# EAGLE design stepperdriver (EAGLE 5.03)
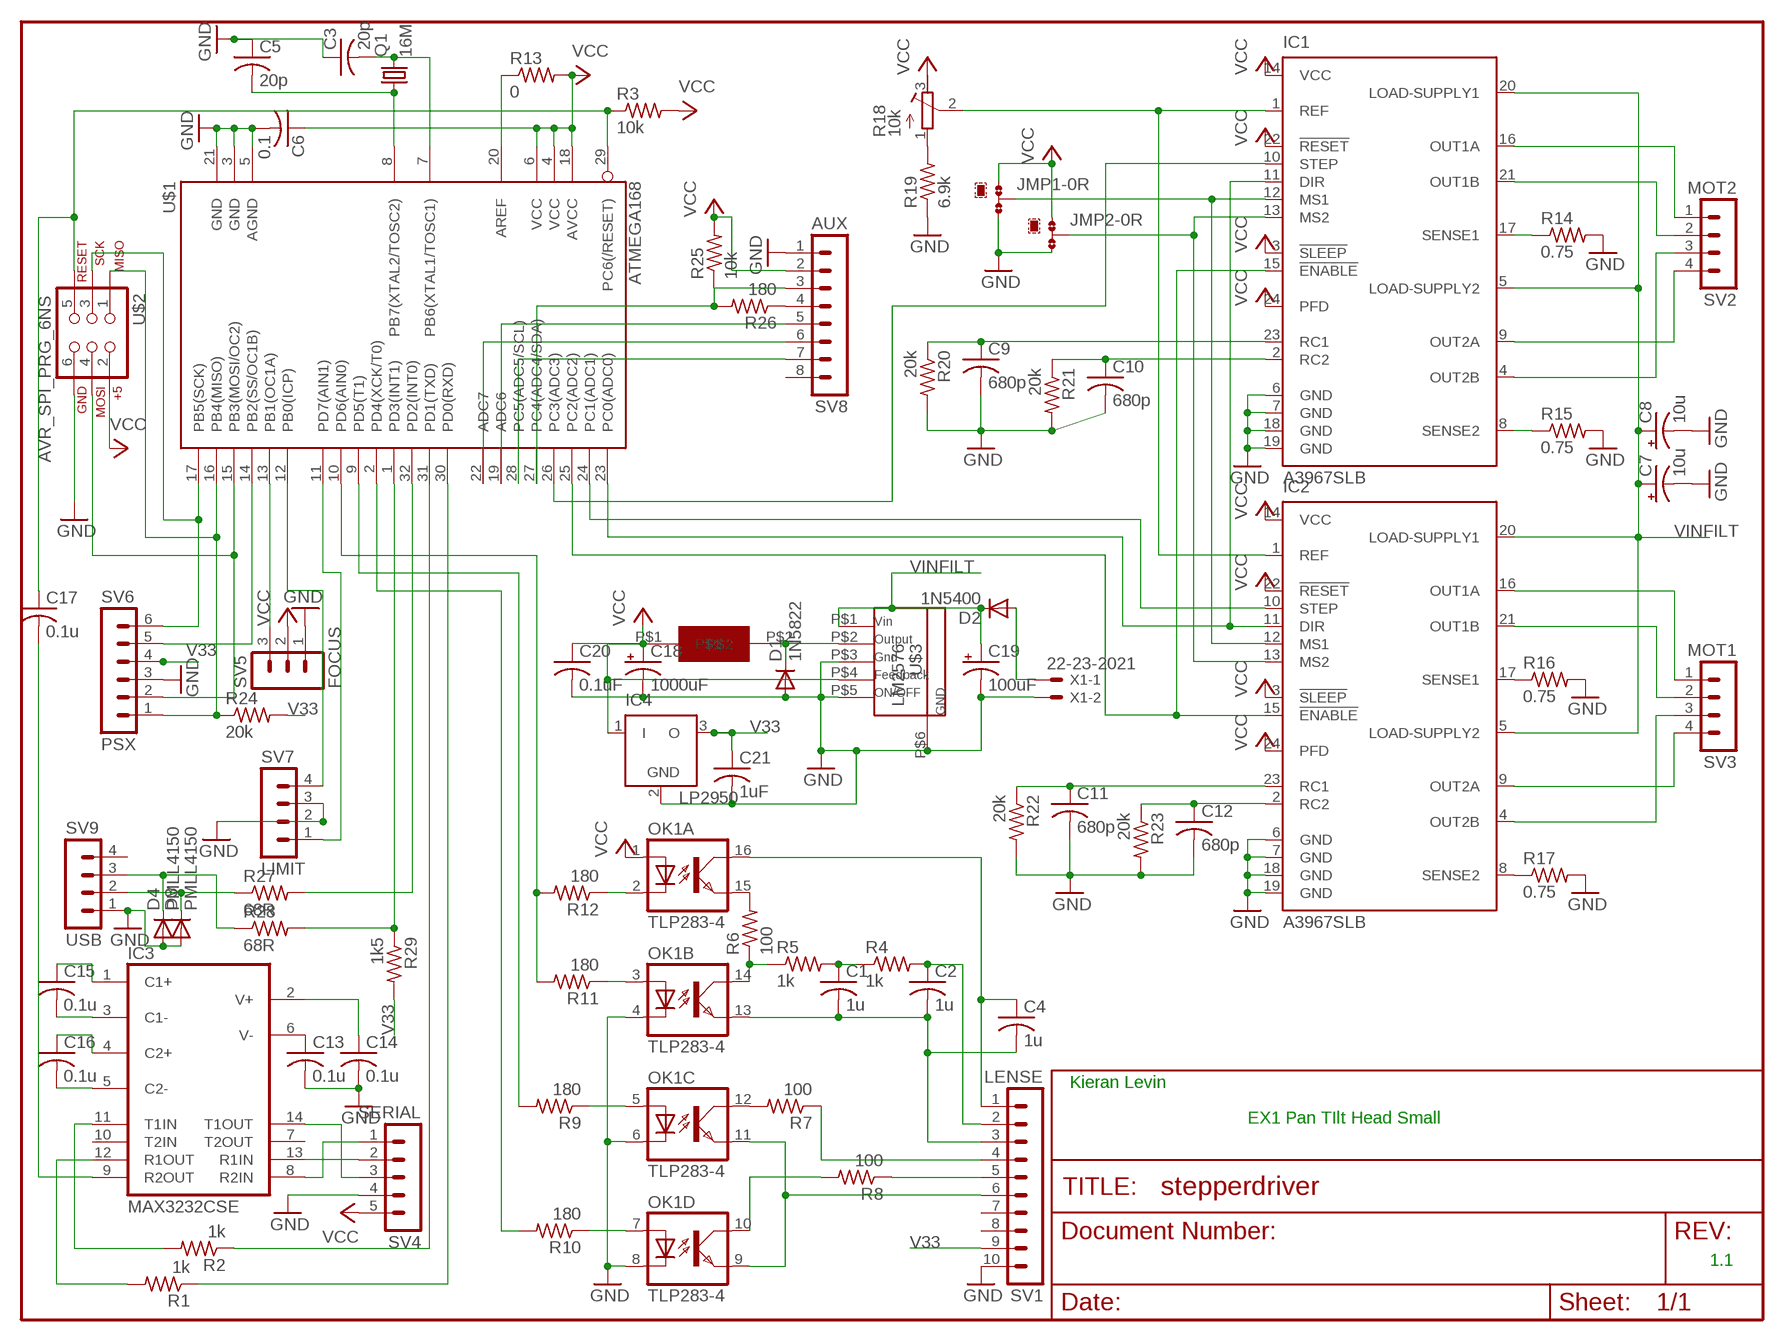
[diagram p0: schematic, sheet 1]

## Parts
C1  1u  C-USC1206  [C1206]
C2  1u  C-USC1206  [C1206]
C3  20p  C-USC1206  [C1206]
C4  1u  C-USC1206  [C1206]
C5  20p  C-USC1206  [C1206]
C6  0.1  C-USC1206  [C1206]
C7  10u  CPOL-USE2.5-5  [E2,5-5]
C8  10u  CPOL-USE2.5-5  [E2,5-5]
C9  680p  C-USC1206  [C1206]
C10  680p  C-USC1206  [C1206]
C11  680p  C-USC1206  [C1206]
C12  680p  C-USC1206  [C1206]
C13  0.1u  C-USC1206  [C1206]
C14  0.1u  C-USC1206  [C1206]
C15  0.1u  C-USC1206  [C1206]
C16  0.1u  C-USC1206  [C1206]
C17  0.1u  C-USC1206  [C1206]
C18  1000uF  CPOL-USE3.5-8  [E3,5-8]
C19  100uF  CPOL-USE3.5-8  [E3,5-8]
C20  0.1uF  C-USC1206  [C1206]
C21  1uF  C-USC1206  [C1206]
D1  1N5822  1N5400  [DO201-15]
D2  1N5400  [DO201-15]
D3  PMLL4150  [SOD80C]
D4  PMLL4150  [SOD80C]
IC1  A3967SLB  [SO24W]
IC2  A3967SLB  [SO24W]
IC3  MAX3232CSE  [SO16]
IC4  LP2950  [DPACK]
JMP1  0R-JUMPA  [A0R-JMP]
JMP2  0R-JUMPA  [A0R-JMP]
OK1  TLP283-4  [MINI-FLAT-16]
Q1  16M  CRYSTALHC49S  [HC49/S]
R1  1k  R-US_R1206  [R1206]
R2  1k  R-US_R1206  [R1206]
R3  10k  R-US_R1206  [R1206]
R4  1k  R-US_R1206  [R1206]
R5  1k  R-US_R1206  [R1206]
R6  100  R-US_R1206  [R1206]
R7  100  R-US_R1206  [R1206]
R8  100  R-US_R1206  [R1206]
R9  180  R-US_R1206  [R1206]
R10  180  R-US_R1206  [R1206]
R11  180  R-US_R1206  [R1206]
R12  180  R-US_R1206  [R1206]
R13  0  R-US_R1206  [R1206]
R14  0.75  R-US_R1206  [R1206]
R15  0.75  R-US_R1206  [R1206]
R16  0.75  R-US_R1206  [R1206]
R17  0.75  R-US_R1206  [R1206]
R18  10k  R-TRIMM3314J  [RTRIM3314J]
R19  6.9k  R-US_R1206  [R1206]
R20  20k  R-US_R1206  [R1206]
R21  20k  R-US_R1206  [R1206]
R22  20k  R-US_R1206  [R1206]
R23  20k  R-US_R1206  [R1206]
R24  20k  R-US_R1206  [R1206]
R25  10k  R-US_R1206  [R1206]
R26  180  R-US_R1206  [R1206]
R27  68R  R-US_R1206  [R1206]
R28  68R  R-US_R1206  [R1206]
R29  1k5  R-US_R1206  [R1206]
SV1  LENSE  MA10-1  [MA10-1]
SV2  MOT2  MA04-1  [MA04-1]
SV3  MOT1  MA04-1  [MA04-1]
SV4  SERIAL  MA05-1  [MA05-1]
SV5  FOCUS  MA03-1  [MA03-1]
SV6  PSX  MA06-1  [MA06-1]
SV7  LIMIT  MA04-1  [MA04-1]
SV8  AUX  MA08-1  [MA08-1]
SV9  USB  MA04-1  [MA04-1]
U$1  ATMEGA168  [TQFP32-08]
U$2  AVR_SPI_PRG_6NS  [2X3-NS]
U$3  LM2576  [TO263-5]
U$4  IND-DR127-COILTRONIX-  [IND-DR127-SERIES]
X1  22-23-2021  [22-23-2021]

## Nets
GND: C3.1 C5.1 C6.2 C7.- C8.- C9.2 C10.2 C11.2 C12.2 C13.2 C14.2 C18.- C19.- C20.2 C21.2 D1.A D3.A D4.A IC1.6(GND) IC1.7(GND) IC1.18(GND) IC1.19(GND) IC2.6(GND) IC2.7(GND) IC2.18(GND) IC2.19(GND) IC4.2(GND) JMP1.3 JMP2.3 OK1.4(B:C) OK1.6(C:C) OK1.8(D:C) R14.2 R15.2 R16.2 R17.2 R19.1 R20.2 R21.2 R22.2 R23.2 SV1.10 SV4.4 SV5.1 SV6.3 SV7.2 SV7.3 SV8.1 SV9.1 U$1.3(GND) U$1.5(AGND) U$1.21(GND) U$2.6 U$3.P$3 U$3.P$5 U$3.P$6 X1.2
N$1: C17.1 R3.1 U$1.29(PC6(/RESET)) U$2.5
N$2: SV6.2 U$1.15(PB3(MOSI/OC2)) U$2.4
N$3: R24.1 SV6.1 U$1.16(PB4(MISO)) U$2.1
N$4: SV6.6 U$1.17(PB5(SCK)) U$2.3
N$5: OK1.15(A:EMIT) R6.2
N$6: OK1.14(B:COL) R5.1 R6.1
N$7: C1.1 R4.1 R5.2
N$8: C2.1 R4.2 SV1.2
N$9: C1.2 C2.2 C4.2 OK1.13(B:EMIT) SV1.3
N$10: OK1.12(C:COL) R7.2
N$11: OK1.10(D:COL) R8.2
N$12: C4.1 OK1.16(A:COL) SV1.1
N$13: R7.1 SV1.4
N$14: R8.1 SV1.5
N$15: OK1.9(D:EMIT) OK1.11(C:EMIT) SV1.6
N$16: C3.2 Q1.2 U$1.7(PB6(XTAL1/TOSC1))
N$17: OK1.2(A:C) R12.1
N$18: OK1.3(B:A) R11.1
N$19: OK1.5(C:A) R9.1
N$20: OK1.7(D:A) R10.1
N$21: C5.2 Q1.1 U$1.8(PB7(XTAL2/TOSC2))
N$22: R11.2 R12.2 U$1.10(PD6(AIN0))
N$23: IC1.16(OUT1A) SV2.1
N$25: R13.1 U$1.20(AREF)
N$26: IC1.21(OUT1B) SV2.2
N$27: IC1.9(OUT2A) SV2.4
N$28: IC1.4(OUT2B) SV2.3
N$29: IC1.8(SENSE2) R15.1
N$30: IC2.17(SENSE1) R16.1
N$31: IC2.8(SENSE2) R17.1
N$32: IC1.17(SENSE1) R14.1
N$33: IC2.9(OUT2A) SV3.4
N$34: IC2.4(OUT2B) SV3.3
N$35: IC2.21(OUT1B) SV3.2
N$36: IC2.16(OUT1A) SV3.1
N$37: IC1.12(MS1) IC2.12(MS1) JMP1.2
N$38: SV6.5 U$1.14(PB2(SS/OC1B))
N$39: IC1.13(MS2) IC2.13(MS2) JMP2.2
N$40: C10.1 IC1.2(RC2) R21.1
N$41: C11.1 IC2.23(RC1) R22.1
N$42: R18.1(E) R19.2
N$43: IC1.15(!ENABLE) IC2.15(!ENABLE) U$1.25(PC2(ADC2))
N$44: C12.1 IC2.2(RC2) R23.1
N$45: C9.1 IC1.23(RC1) R20.1
N$46: IC1.1(REF) IC2.1(REF) R18.2(S)
N$47: SV5.3 U$1.13(PB1(OC1A))
N$48: IC1.11(DIR) IC2.11(DIR) U$1.23(PC0(ADC0))
N$49: IC1.10(STEP) U$1.26(PC3(ADC3))
N$50: IC2.10(STEP) U$1.24(PC1(ADC1))
N$51: IC3.11(T1IN) R2.2
N$52: C15.2 IC3.3(C1-)
N$53: C15.1 IC3.1(C1+)
N$54: C16.1 IC3.4(C2+)
N$55: C16.2 IC3.5(C2-)
N$56: C13.1 IC3.6(V-)
N$57: C14.1 IC3.2(V+)
N$58: R2.1 U$1.31(PD1(TXD))
N$59: R1.1 U$1.30(PD0(RXD))
N$60: IC3.12(R1OUT) R1.2
N$61: C17.2 IC3.9(R2OUT)
N$62: R9.2 U$1.9(PD5(T1))
N$63: IC3.8(R2IN) SV4.1
N$64: IC3.13(R1IN) SV4.2
N$65: IC3.14(T1OUT) SV4.3
N$66: R10.2 U$1.2(PD4(XCK/T0))
N$67: D1.C U$3.P$2 U$4.P$2
N$68: R26.1 SV8.4
N$69: SV7.4 U$1.12(PB0(ICP))
N$70: SV7.1 U$1.11(PD7(AIN1))
N$71: D2.A X1.1
N$72: SV8.7 U$1.28(PC5(ADC5/SCL))
N$73: R25.1 R26.2 SV8.3 U$1.27(PC4(ADC4/SDA))
N$74: SV8.5 U$1.19(ADC6)
N$75: SV8.6 U$1.22(ADC7)
N$76: R27.2 U$1.32(PD2(INT0))
N$77: R28.2 R29.1 U$1.1(PD3(INT1))
N$79: D3.C R27.1 SV9.2
N$80: D4.C R28.1 SV9.3
V33: C21.1 IC4.3(O) R24.2 R29.2 SV1.9 SV6.4
VCC: C6.1 C18.+ C20.1 IC1.3(!SLEEP) IC1.14(VCC) IC1.22(!RESET) IC1.24(PFD) IC2.3(!SLEEP) IC2.14(VCC) IC2.22(!RESET) IC2.24(PFD) IC4.1(I) JMP1.1 JMP2.1 OK1.1(A:A) R3.2 R13.2 R18.3(A) R25.2 SV4.5 SV5.2 SV8.2 U$1.4(VCC) U$1.6(VCC) U$1.18(AVCC) U$2.2 U$3.P$4 U$4.P$1
VINFILT: C7.+ C8.+ C19.+ D2.C IC1.5(LOAD-SUPPLY2) IC1.20(LOAD-SUPPLY1) IC2.5(LOAD-SUPPLY2) IC2.20(LOAD-SUPPLY1) U$3.P$1
Unconnected: IC3.7(T2OUT) IC3.10(T2IN) SV1.7 SV1.8 SV8.8 SV9.4

## Notes on the sheet
- Kieran Levin
- EX1 Pan TIlt Head Small
- 1.1

## Power pins joined to a net without a drawn wire
GND: IC3.15(GND)
VCC: IC3.16(VCC)

## Library data of the parts
C1-C6 C9-C17 C20 C21 = rcl:C-US: CAPACITOR, American symbol
C7 C8 C18 C19 = rcl:CPOL-US: POLARIZED CAPACITOR, American symbol
D1 D2 = diode:1N5400: DIODE standard rectifier, 3 A, 50 V (Motorola)
D3 D4 = diode:PMLL4150: DIODE high speed
IC1 IC2 = allegro:A3967SLB: MICROSTEPPING DRIVER WITH TRANSLATOR Source: 3967.pdf
IC3 = maxim:MAX3232*: True RS-232 Transceivers 3.0V to 5.5V, Low-Power up to 1Mbps, Using Four 0.1µF External Capacitors Source: http://pdfserv.maxim-ic.com/en/ds/MAX3222-MAX3241.pdf
IC4 = linear:LP2950: 100 mA, Low Power Low Dropout Voltage Regulator Source: http://www.onsemi.com/pub/Collateral/LP2950-D.PDF
JMP1 JMP2 = jump-0r-smd:0R-JUMP: SMD 0R 0805 Jumper
OK1 = optocoupler:TLP283-4: TOSHIBA PHOTOCOUPLER GaAs IRED & PHOTO-TRANSISTOR Source: http://www.semicon.toshiba.co.jp/td/en/Opto/Photocoupler/en_20050928_TLP283_datasheet.pdf
Q1 = crystal:CRYSTAL: CRYSTAL
R1-R17 R19-R29 = rcl:R-US_: RESISTOR, American symbol
R18 = rcl:R-TRIMM: Trimm resistor
SV1 = con-lstb:MA10-1: PIN HEADER
SV2 SV3 SV7 SV9 = con-lstb:MA04-1: PIN HEADER
SV4 = con-lstb:MA05-1: PIN HEADER
SV5 = con-lstb:MA03-1: PIN HEADER
SV6 = con-lstb:MA06-1: PIN HEADER
SV8 = con-lstb:MA08-1: PIN HEADER
U$1 = SparkFun:ATMEGA168
U$2 = SparkFun:AVR_SPI_PRG_6: AVR ISP 6 Pin This is the reduced ISP connector for AVR programming. Common on Arduino. This footprint will take up less PCB space and can be used with a 10-pin to 6-pin adapter such as SKU: BOB-08508
U$3 = KieranCustom:LM2576
U$4 = KieranCustom:IND-DR127-COILTRONIX-: Series DR Inductance 100µH Tolerance ±20% Package / Case 0.492" L x 0.492" W x 0.314" H (12.50mm x 12.50mm x 8.00mm) Current 1.96A Mounting Type Surface Mount Manufacturer Part Number DR127-101-R Digi-Key Part Number 513-1038-1-ND
X1 = con-molex:22-23-2021: .100" (2.54mm) Center Header - 2 Pin

## Board
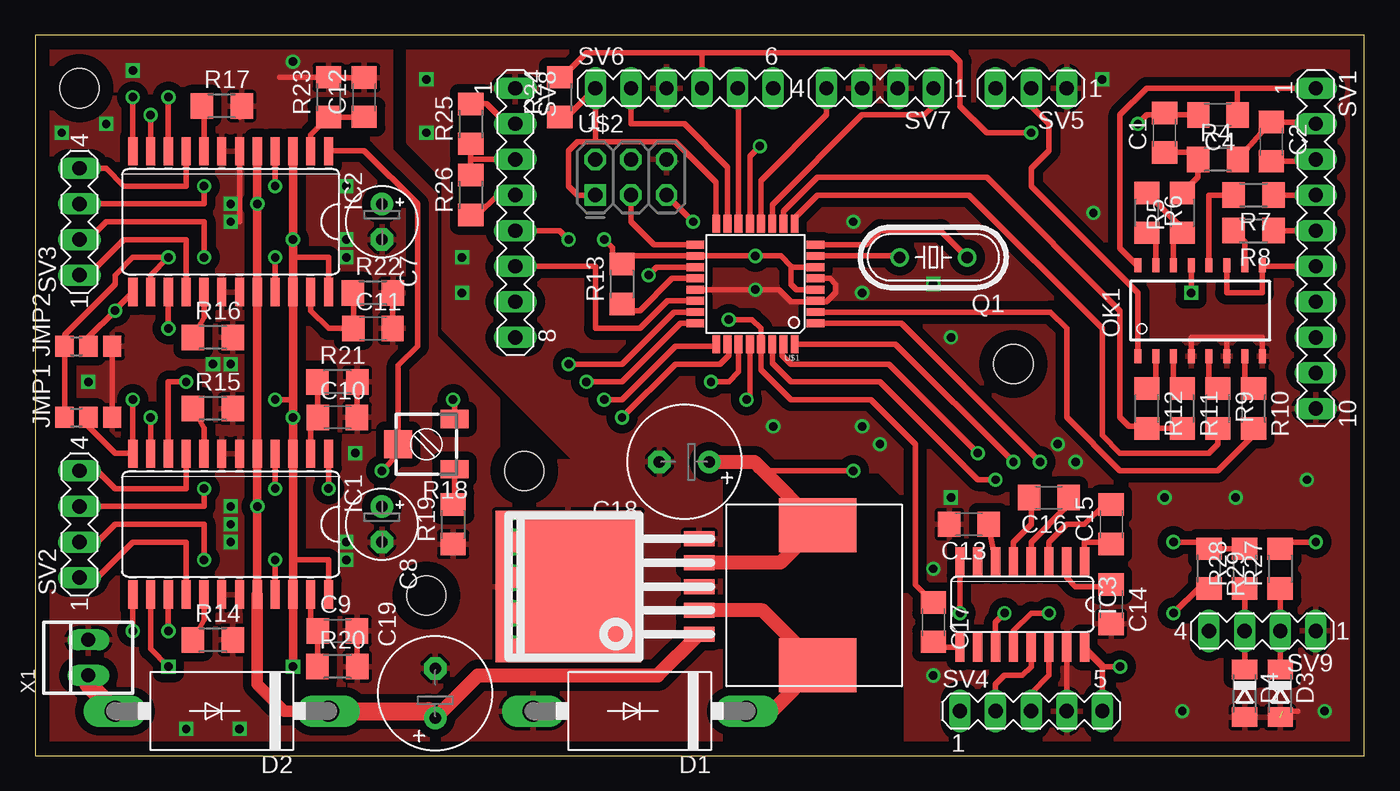
[diagram p1: board, top side]
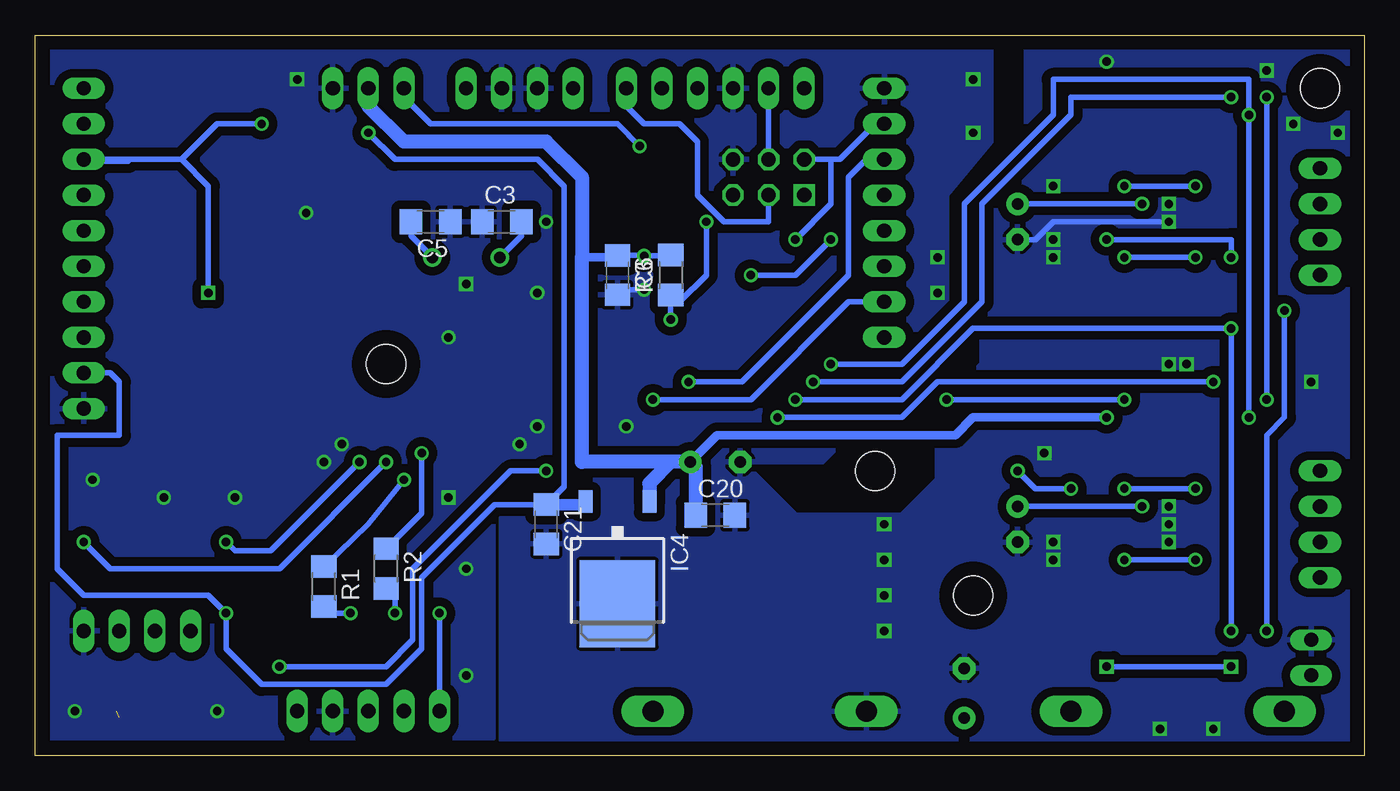
[diagram p2: board, bottom side, seen from below]

Size 94.92 x 51.42 mm. Coordinates in mm from the lower left corner, seen from the top.
Outline: 0,0 94.92,0 94.92,51.42 0,51.42 0,0
Copper layers (1*16): Top 0.035mm / dielectric 1.5mm / Bottom 0.035mm
Design rules "default *": minimum track width 7mil, minimum drill 15mil, track to track 7mil, track to pad 7mil, pad to pad 7mil, via to via 7mil, smd to smd 7mil, copper to edge 40mil, drill to drill 8mil, minimum pad ring 10mil, minimum via ring 8mil, stop-mask expansion 4mil, vias tented up to drill 0mil, thermal gap 10mil
Holes 2.8 mm at 3.17,47.62 27.94,11.43 69.85,27.94 34.92,20.32

### Footprints (pad centres in the part's own frame; a part is rotated, then mirrored left to right if it is on the bottom)
C1206 = smd 1.6 x 1.8: 1 -1.4,0; 2 1.4,0
E2,5-5 = drill 0.813 pad 1.6 round: + -1.27,0 | drill 0.813 pad 1.6 octagon: - 1.27,0
E3,5-8 = drill 0.813 pad 1.6 round: + -1.778,0 | drill 0.813 pad 1.6 octagon: - 1.778,0
DO201-15 = drill 1.499 long: A 7.62,0; C -7.62,0
SOD80C = smd 1.4 x 1.8: A 1.7,0; C -1.7,0
SO24W = smd 0.66 x 2.032: 1 -6.985,-5.029; 2 -5.715,-5.029; 3 -4.445,-5.029; 4 -3.175,-5.029; 5 -1.905,-5.029; 6 -0.635,-5.029; 7 0.635,-5.029; 8 1.905,-5.029; 9 3.175,-5.029; 10 4.445,-5.029; 11 5.715,-5.029; 12 6.985,-5.029; 13 6.985,5.029; 14 5.715,5.029; 15 4.445,5.029; 16 3.175,5.029; 17 1.905,5.029; 18 0.635,5.029; 19 -0.635,5.029; 20 -1.905,5.029; 21 -3.175,5.029; 22 -4.445,5.029; 23 -5.715,5.029; 24 -6.985,5.029
SO16 = smd 0.66 x 2.032: 1 -4.445,-3.073; 2 -3.175,-3.073; 3 -1.905,-3.073; 4 -0.635,-3.073; 5 0.635,-3.073; 6 1.905,-3.073; 7 3.175,-3.073; 8 4.445,-3.073; 9 4.445,3.073; 10 3.175,3.073; 11 1.905,3.073; 12 0.635,3.073; 13 -0.635,3.073; 14 -1.905,3.073; 15 -3.175,3.073; 16 -4.445,3.073
DPACK = smd 1 x 1.6: 1 -2.28,-4.8; 3 2.28,-4.8 | smd 5.4 x 6.2: 2 0,2.5
A0R-JMP = smd 1.5 x 1.3: 1 0,1.7; 2 0,0; 3 0,-1.7
MINI-FLAT-16 = smd 1 x 0.5: 1 -3.24,4.445; 2 -3.24,3.175; 3 -3.24,1.905; 4 -3.24,0.635; 5 -3.24,-0.635; 6 -3.24,-1.905; 7 -3.24,-3.175; 8 -3.24,-4.445; 9 3.24,-4.445; 10 3.24,-3.175; 11 3.24,-1.905; 12 3.24,-0.635; 13 3.24,0.635; 14 3.24,1.905; 15 3.24,3.175; 16 3.24,4.445
HC49/S = drill 0.813 round: 1 -2.413,0; 2 2.413,0
R1206 = smd 1.6 x 1.803: 1 -1.422,0; 2 1.422,0
RTRIM3314J = smd 1.3 x 2: 1 -1.8,-2; 3 1.8,-2 | smd 2 x 2: 2 0,2
MA10-1 = drill 1.016 long: 1 -11.43,0; 2 -8.89,0; 3 -6.35,0; 4 -3.81,0; 5 -1.27,0; 6 1.27,0; 7 3.81,0; 8 6.35,0; 9 8.89,0; 10 11.43,0
MA04-1 = drill 1.016 long: 1 -3.81,0; 2 -1.27,0; 3 1.27,0; 4 3.81,0
MA05-1 = drill 1.016 long: 1 -5.08,0; 2 -2.54,0; 3 0,0; 4 2.54,0; 5 5.08,0
MA03-1 = drill 1.016 long: 1 -2.54,0; 2 0,0; 3 2.54,0
MA06-1 = drill 1.016 long: 1 -6.35,0; 2 -3.81,0; 3 -1.27,0; 4 1.27,0; 5 3.81,0; 6 6.35,0
MA08-1 = drill 1.016 long: 1 -8.89,0; 2 -6.35,0; 3 -3.81,0; 4 -1.27,0; 5 1.27,0; 6 3.81,0; 7 6.35,0; 8 8.89,0
TQFP32-08 = smd 1.27 x 0.559: 1 -4.293,2.8; 2 -4.293,2; 3 -4.293,1.2; 4 -4.293,0.4; 5 -4.293,-0.4; 6 -4.293,-1.2; 7 -4.293,-2; 8 -4.293,-2.8; 17 4.293,-2.8; 18 4.293,-2; 19 4.293,-1.2; 20 4.293,-0.4; 21 4.293,0.4; 22 4.293,1.2; 23 4.293,2; 24 4.293,2.8 | smd 0.559 x 1.27: 9 -2.8,-4.293; 10 -2,-4.293; 11 -1.2,-4.293; 12 -0.4,-4.293; 13 0.4,-4.293; 14 1.2,-4.293; 15 2,-4.293; 16 2.8,-4.293; 25 2.8,4.293; 26 2,4.293; 27 1.2,4.293; 28 0.4,4.293; 29 -0.4,4.293; 30 -1.2,4.293; 31 -2,4.293; 32 -2.8,4.293
2X3-NS = drill 1.016 square: 1 -2.54,-1.27 | drill 1.016 octagon: 2 -2.54,1.27; 3 0,-1.27; 4 0,1.27; 5 2.54,-1.27; 6 2.54,1.27
TO263-5 = smd 1.07 x 2.16: P$1 -3.4,-1.7; P$2 -1.7,-1.7; P$3 0,-1.7; P$4 1.7,-1.7; P$5 3.4,-1.7 | smd 10.8 x 10.41: P$6 0,7.65
IND-DR127-SERIES = smd 3.85 x 5.5: P$1 -5,0; P$2 5,0
22-23-2021 = drill 1 long: 1 -1.27,0; 2 1.27,0

### Placement (x,y rotation side)
C1  80.64,44.45 90 top
C2  88.27,43.81 270 top
C3  61.59,38.1 0 bottom
C4  84.45,45.72 180 top
C5  66.67,38.1 180 bottom
C6  53.34,34.29 270 bottom
C7  24.77,38.1 270 top
C8  24.77,16.51 270 top
C9  21.59,8.89 0 top
C10  21.59,24.13 0 top
C11  24.13,30.48 0 top
C12  23.5,46.99 90 top
C13  66.67,16.51 180 top
C14  76.83,10.79 270 top
C15  76.83,16.51 90 top
C16  72.39,18.41 180 top
C17  64.14,9.53 270 top
C18  46.35,20.95 180 top
C19  28.57,4.45 90 top
C20  46.35,17.14 0 bottom
C21  58.42,16.51 270 bottom
D1  43.18,3.17 180 top
D2  13.34,3.17 180 top
D3  88.9,4.45 270 top
D4  86.36,4.45 270 top
IC1  13.97,16.51 180 top
IC2  13.97,38.1 180 top
IC3  70.48,10.79 180 top
IC4  53.34,13.34 180 bottom
JMP1  3.81,24.13 90 top
JMP2  3.81,29.21 90 top
OK1  83.19,31.75 90 top
Q1  64.14,35.56 180 top
R1  74.3,12.06 270 bottom
R2  69.85,13.34 270 bottom
R3  49.53,34.29 90 bottom
R4  84.45,42.55 0 top
R5  81.92,38.73 90 top
R6  79.38,38.73 270 top
R7  87,40.01 180 top
R8  87,37.47 180 top
R9  84.45,24.77 270 top
R10  87,24.77 270 top
R11  81.92,24.77 270 top
R12  79.38,24.77 270 top
R13  41.91,33.66 90 top
R14  12.7,8.26 0 top
R15  12.7,24.77 0 top
R16  12.7,29.84 0 top
R17  13.34,46.35 0 top
R18  27.94,22.23 90 top
R19  29.84,16.51 90 top
R20  21.59,6.35 0 top
R21  21.59,26.67 0 top
R22  24.13,33.02 0 top
R23  20.95,46.99 90 top
R24  37.47,46.99 90 top
R25  31.11,45.09 90 top
R26  31.11,40.01 90 top
R27  88.9,13.34 90 top
R28  86.36,13.34 90 top
R29  83.82,13.34 270 top
SV1  91.44,36.2 270 top
SV2  3.17,16.51 90 top
SV3  3.17,38.1 90 top
SV4  71.12,3.17 0 top
SV5  71.12,47.62 180 top
SV6  46.35,47.62 0 top
SV7  60.33,47.62 180 top
SV8  34.29,38.73 270 top
SV9  87.63,8.89 180 top
U$1  51.44,33.66 180 top
U$2  42.55,41.27 0 top
U$3  45.72,12.06 90 top
U$4  55.88,11.43 270 top
X1  3.81,6.99 90 top

### Tracks (layer width: path | path; a pad name or v marks a point on that pad's centre or on a via)
GND  (via drill 0.6)  (1 unrouted)
  Top 0.406: 14.61,45.57 R17.2 | C12.2 20.98,48.39 R23.2 17.45,48.41 | C11.2 25.53,33 R22.2 | JMP1.3 JMP2.3 | 14.61,38.1 IC2.6 | R20.2 22.99,6.37 C9.2 | R21.2 23.01,24.15 C10.2 | 89.11,3.17 90.17,3.17 | U$1.21 v51.44,33.26 53.1,33.26 53.98,32.38 55.66,32.38 U$1.3 55.8,32.38 56.52,32.38 57.15,33.02 57.15,33.66 56.75,34.05 U$1.5 | SV4.4 IC3.15 | OK1.4 82.55,29.84 85.09,29.84 | 85.09,29.84 OK1.6 | OK1.8 87.63,29.84 85.09,29.84
  Bottom 0.406: C7.- 23.5,36.83 22.23,38.1 14.61,38.1 | C6.2 52.98,33.26 v51.44,33.26
  other vias: 22.23,13.97 22.86,21.59 22.23,35.56 22.23,40.64 13.97,39.37 13.97,15.24 1.91,44.45 34.29,16.51 34.29,13.97 34.29,11.43 34.29,8.89 13.97,27.94 12.7,27.94 13.97,16.51 13.97,17.78 22.23,15.24 13.97,38.1 22.23,36.83 3.81,26.67 30.48,35.56 30.48,33.02 27.94,44.45 27.94,48.26 65.41,18.41 76.2,48.26 64.14,33.66 58.42,38.1 59.05,33.02 6.99,48.9 65.41,29.84 85.72,18.41 73.03,22.23 75.56,38.73 80.64,18.41 90.81,19.68 81.92,3.17 92.08,3.17 64.14,13.34 64.14,5.71 74.3,20.95 18.41,49.53 5.08,45.09 10.79,1.91 14.61,1.91 52.7,23.5 59.05,23.5 60.33,22.23
  pour Top (isolate 0.61): 0,0 0,51.44 25.4,51.44 25.4,43.18 28.57,40.01 28.57,29.84 33.02,25.4 33.02,20.95 41.27,20.95 43.18,23.5 48.9,23.5 48.9,0
  pour Bottom (isolate 0.61): 0,0 0,51.44 24.13,51.44 24.13,42.55 27.3,39.37 27.3,27.94 30.48,24.77 30.48,19.68 33.02,17.14 40.64,17.14 44.45,20.95 58.42,20.95 61.59,17.78 61.59,0
  pour Top (isolate 0.61): 26.67,51.44 93.98,51.44 93.98,0 62.23,0 62.23,18.41 60.33,20.32 39.37,20.32 29.21,30.48 29.21,41.27 26.67,43.81
  pour Bottom (isolate 0.61): 26.67,50.8 93.98,50.8 93.98,1.27 62.23,1.27 62.23,18.41 59.69,20.95 38.73,20.95 29.84,29.84 29.84,40.01 26.67,43.81
N$1  (via drill 0.6)
  Top 0.406: v46.99,38.1 U$2.5 | v49.53,31.11 51.2,31.11 51.84,30.48 U$1.29 51.84,27.54 53.98,25.4 59.69,25.4 62.87,22.23 62.87,12.2 C17.1
  Bottom 0.406: v49.53,31.11 R3.1 49.05,32.38 48.9,32.38 46.99,34.29 v46.99,38.1
N$2
  Top 0.406: U$1.15 49.44,42.01 46.35,45.09 42.55,45.09 SV6.2
  Bottom 0.406: U$2.4 SV6.2
N$3
  Top 0.406: U$1.16 48.63,40.9 45.72,43.81 40.01,43.81 | 40.01,43.81 SV6.1 | SV6.1 39.22,46.84 | R24.1 37.95,45.57 SV6.1 | U$2.1 38.73,40.01 38.1,40.64 38.1,43.18 38.73,43.81 40.01,43.81
N$4
  Top 0.406: U$1.17 44.19,36.45 42.55,38.1 U$2.3
  Bottom 0.406: U$2.3 42.55,38.1 45.72,38.1 47.62,40.01 47.62,43.81 48.9,45.09 51.44,45.09 52.7,46.35 SV6.6
N$5
  Top 0.406: R6.2 80.01,37.31 OK1.15
N$6
  Top 0.406: OK1.14 81.28,37.31 R5.1 81.92,37.62 R6.1
N$7
  Top 0.406: R5.2 83.03,41.27 R4.1 82.53,43.05 C1.1
N$8
  Top 0.406: R4.2 88.14,45.09 C2.1 90.67,45.22 SV1.2
N$9  (via drill 0.6)
  Top 0.406: C2.2 90.67,42.41 SV1.3 | OK1.13 v82.55,33.02 | C1.2 80.78,45.72 C4.2 79.38,45.72 v78.74,45.09
  Bottom 0.406: C2.2 91.44,42.41 SV1.3 84.45,42.55 | v82.55,33.02 82.55,40.64 84.45,42.55 | 84.45,42.55 81.92,45.09 v78.74,45.09
N$10
  Top 0.406: R7.2 83.82,40.01 OK1.12
N$11
  Top 0.406: R8.2 86.36,36.68 OK1.10
N$12
  Top 0.406: 85.86,47.62 SV1.1 | 85.86,47.62 C4.1 | OK1.16 78.67,34.99 77.47,36.2 77.47,45.72 79.38,47.62 85.86,47.62
N$13
  Top 0.406: R7.1 SV1.4
N$14
  Top 0.406: R8.1 SV1.5
N$15
  Top 0.406: SV1.6 87.63,34.92 OK1.9 87.63,33.02 85.09,33.02 OK1.11
N$16
  Top 0.406: U$1.7 61.63,35.66 Q1.2
  Bottom 0.406: C3.2 60.2,37.09 Q1.2
N$17
  Top 0.406: OK1.2 80.01,26.82 R12.1
N$18
  Top 0.406: OK1.3 81.28,26.82 R11.1
N$19
  Top 0.406: OK1.5 83.82,26.82 R9.1
N$20
  Top 0.406: OK1.7 86.36,26.82 R10.1
N$21
  Top 0.406: U$1.8 59.31,36.45 60.33,37.47 64.64,37.47 Q1.1
  Bottom 0.406: C5.2 68.08,37.09 Q1.1
N$22
  Top 0.406: R11.2 R12.2 79.22,23.5 78.11,23.5 77.47,24.13 77.47,31.75 67.94,41.27 55.88,41.27 53.44,38.83 U$1.10
N$23
  Top 0.406: IC1.16 10.79,15.24 6.99,15.24 4.45,12.7 SV2.1
N$25
  Top 0.406: U$1.20 45.48,34.05 43.18,31.75 41.76,31.75 R13.1
N$26  (via drill 0.6)
  Top 0.406: v17.14,13.97 IC1.21 | v12.06,13.97 12.06,16.51 5.71,16.51 4.45,15.24 SV2.2
  Bottom 0.406: v12.06,13.97 v17.14,13.97
N$27
  Top 0.406: SV2.4 4.45,20.32 5.71,19.05 10.79,19.05 IC1.9
N$28  (via drill 0.6)
  Top 0.406: SV2.3 12.06,17.78 v12.06,19.05 | v17.14,19.05 IC1.4
  Bottom 0.406: v12.06,19.05 v17.14,19.05
N$29
  Top 0.406: R15.1 12.06,23.34 IC1.8
N$30
  Top 0.406: IC2.17 12.06,31.27 R16.1
N$31
  Top 0.406: IC2.8 12.06,45.57 R17.1
N$32
  Top 0.406: R14.1 12.06,9.68 IC1.17
N$33
  Top 0.406: SV3.4 5.08,41.91 6.35,40.64 10.79,40.64 IC2.9
N$34  (via drill 0.6)
  Top 0.406: SV3.3 12.06,39.37 v12.06,40.64 | v17.14,40.64 IC2.4
  Bottom 0.406: v12.06,40.64 v17.14,40.64
N$35  (via drill 0.6)
  Top 0.406: v12.06,35.56 12.06,38.1 5.08,38.1 3.81,36.83 SV3.2 | v17.14,35.56 IC2.21
  Bottom 0.406: v12.06,35.56 v17.14,35.56
N$36
  Top 0.406: SV3.1 3.81,34.29 6.35,36.83 10.79,36.83 IC2.16
N$37  (via drill 0.6)
  Top 0.406: v6.99,46.99 IC2.12 | v6.99,25.4 IC1.12 6.93,21.59 5.71,21.59 3.81,23.5 JMP1.2
  Bottom 0.406: v6.99,25.4 v6.99,46.99
N$38
  Top 0.406: U$1.14 50.23,47.55 SV6.5
N$39  (via drill 0.6)
  Top 0.406: IC2.13 5.71,31.8 v5.71,31.75 3.81,29.84 JMP2.2 | v6.99,8.89 IC1.13
  Bottom 0.406: v5.71,31.75 5.71,24.13 6.99,22.86 v6.99,8.89
N$40
  Top 0.406: IC1.2 19.68,23.62 C10.1 20.19,26.65 R21.1
N$41
  Top 0.406: IC2.23 19.68,31.75 20.95,30.48 C11.1 22.73,33 R22.1
N$42
  Top 0.406: R18.1 29.94,18.03 R19.2
N$43  (via drill 0.6)
  Top 0.406: v9.53,30.48 IC2.15 | v9.53,8.89 IC1.15 | 48.63,28.95 U$1.25 48.48,29.21 45.72,29.21 41.91,25.4 v40.64,25.4
  Bottom 0.406: v9.53,8.89 v9.53,30.48 27.94,30.48 33.02,25.4 v40.64,25.4
N$44
  Top 0.406: IC2.2 19.68,44.3 R23.1 23.47,45.57 C12.1
N$45
  Top 0.406: R20.1 20.17,8.87 C9.1 19.68,9.39 IC1.23
N$46  (via drill 0.6)
  Top 0.406: v24.77,20.32 25.94,21.5 R18.2 25.94,27.84 27.3,29.21 27.3,39.37 23.5,43.18 21.01,43.18 IC2.1 | v20.95,19.05 IC1.1
  Bottom 0.406: v24.77,20.32 23.5,19.05 v20.95,19.05
N$47  (via drill 0.6)
  Top 0.406: U$1.13 51.03,42.78 v51.75,43.5
  Bottom 0.406: SV5.3 68.58,46.99 66.67,45.09 53.34,45.09 v51.75,43.5
N$48  (via drill 0.6)
  Top 0.406: v8.26,45.72 IC2.11 | U$1.23 45.62,31.66 41.91,27.94 v38.1,27.94 | IC1.11 v8.26,24.13 IC1.11
  Bottom 0.406: 8.26,31.75 v8.26,45.72 | v8.26,24.13 8.26,31.75 | 8.26,31.75 8.26,48.26 22.23,48.26 22.23,45.72 28.57,39.37 28.57,32.38 33.02,27.94 v38.1,27.94
N$49  (via drill 0.6)
  Top 0.406: IC1.10 9.53,26.67 v10.79,26.67 | U$1.26 49.53,29.27 49.53,28.57 48.9,27.94 45.72,27.94 v41.91,24.13
  Bottom 0.406: v10.79,26.67 30.48,26.67 33.02,24.13 v41.91,24.13
N$50  (via drill 0.6)
  Top 0.406: IC2.10 v9.53,46.99 | U$1.24 46.09,30.86 41.91,26.67 v39.37,26.67
  Bottom 0.406: v9.53,46.99 20.95,46.99 20.95,45.72 27.3,39.37 27.3,32.38 33.02,26.67 v39.37,26.67
N$51  (via drill 0.6)
  Top 0.406: 68.58,7.62 IC3.11 68.58,9.53 v69.22,10.16
  Bottom 0.406: v69.22,10.16 69.22,11.28 R2.2
N$52
  Top 0.406: C15.2 76.33,17.91 74.93,16.51 73.66,16.51 72.39,15.24 IC3.3
N$53
  Top 0.406: IC3.1 74.93,15.24 76.83,15.24 C15.1
N$54
  Top 0.406: IC3.4 71.12,15.24 73.66,17.78 73.66,18.29 C16.1
N$55
  Top 0.406: IC3.5 69.85,15.24 71.12,16.51 71.12,18.29 C16.2
N$56
  Top 0.406: IC3.6 C13.1
N$57
  Top 0.406: IC3.2 73.66,12.7 74.3,12.06 76.7,12.06 C14.1
N$58  (via drill 0.6)
  Top 0.406: U$1.31 53.34,29.27 53.34,28.57 53.98,27.94 60.96,27.94 v67.31,21.59
  Bottom 0.406: v67.31,21.59 67.31,17.3 R2.1
N$59  (via drill 0.6)
  Top 0.406: U$1.30 52.63,28.01 53.98,26.67 60.33,26.67 67.31,19.68 v68.58,19.68
  Bottom 0.406: v68.58,19.68 71.12,16.51 R1.1
N$60  (via drill 0.6)
  Top 0.406: IC3.12 69.85,8.89 71.12,10.16 v72.39,10.16
  Bottom 0.406: v72.39,10.16 73.81,10.16 R1.2
N$61
  Top 0.406: IC3.9 63.9,7.72 C17.2
N$62
  Top 0.406: U$1.9 54.23,38.36 55.88,40.01 66.67,40.01 76.2,30.48 76.2,22.86 77.47,21.59 83.82,21.59 84.45,22.23 R9.2
N$63  (via drill 0.6)
  Top 0.406: v66.04,10.16 IC3.8
  Bottom 0.406: SV4.1 v66.04,10.16
N$64
  Top 0.406: IC3.13 71.12,6.35 70.48,5.71 69.22,5.71 68.58,5.08 SV4.2
N$65
  Top 0.406: IC3.14 72.39,5.71 71.12,4.45 SV4.3
N$66
  Top 0.406: R10.2 87,22.86 84.45,20.32 77.47,20.32 73.66,24.13 73.66,30.48 72.48,31.66 U$1.2
N$67
  Top 1.016: U$3.P$2 51.95,10.37 U$4.P$2 52.62,3.17 D1.C
N$68
  Top 0.406: R26.1 31.6,38.58 33.02,40.01 SV8.4
N$69
  Top 0.406: U$1.12 51.84,41.04 56.52,45.72 SV7.4
N$70
  Top 0.406: SV7.1 64.14,46.35 63.5,45.72 59.05,45.72 52.63,39.3 U$1.11
N$71
  Top 1.27: X1.1 3.81,5.08 D2.A
N$72  (via drill 0.6)
  Top 0.406: U$1.28 51.03,25.64 v50.8,25.4
  Bottom 0.406: v50.8,25.4 43.81,25.4 36.83,32.38 SV8.7
N$73  (via drill 0.6)
  Top 0.406: 31.27,41.27 R26.2 31.11,42.55 | U$1.27 50.23,27.38 49.53,26.67 v48.26,26.67 | 31.11,42.55 R25.1 | SV8.3 31.11,42.55
  Bottom 0.406: v48.26,26.67 44.45,26.67 36.83,34.29 36.83,41.27 35.56,42.55 SV8.3
N$74  (via drill 0.6)
  Top 0.406: U$1.19 44.38,34.85 v43.81,34.29 | v38.1,36.83 37.47,37.47 SV8.5
  Bottom 0.406: v43.81,34.29 40.64,34.29 v38.1,36.83
N$75
  Top 0.406: U$1.22 45.16,32.45 43.18,30.48 40.01,30.48 40.01,34.92 SV8.6
N$76  (via drill 0.6)
  Top 0.406: v91.44,15.24 89.38,15.24 R27.2 | U$1.32 61.44,29.36 v69.85,20.95
  Bottom 0.406: v69.85,20.95 77.47,13.34 89.53,13.34 v91.44,15.24
N$77  (via drill 0.6)
  Top 0.406: R28.2 R29.1 83.34,15.24 v81.28,15.24 | U$1.1 61.85,30.86 v71.75,20.95
  Bottom 0.406: v71.75,20.95 78.11,14.61 80.64,14.61 v81.28,15.24
N$79
  Top 0.406: R27.1 SV9.2 D3.C
N$80
  Top 0.406: D4.C SV9.3 R28.1
V33  (via drill 0.6)
  Top 0.254: 84.45,12.7 84.45,11.43 R29.2
  Top 0.406: 47.62,50.16 39.37,50.16 37.62,48.41 R24.2 | 84.45,12.7 83.82,12.06 | v81.28,10.16 83.19,12.06 83.67,12.06 R29.2 | 47.62,50.16 SV6.4 | 47.62,50.16 65.41,50.16 66.04,49.53 66.04,46.35 67.94,44.45 v71.12,44.45
  Bottom 0.406: SV1.9 89.53,27.3 88.9,26.67 88.9,22.86 93.34,22.86 93.34,13.34 91.44,11.43 82.55,11.43 v81.28,10.16 81.28,7.62 78.74,5.08 69.85,5.08 67.31,7.62 67.31,12.7 62.1,17.91 C21.1 57.15,19.18 57.15,40.64 59.05,42.55 69.22,42.55 v71.12,44.45
  Bottom 0.813: IC4.3 55.84,17.91 C21.1
VCC  (via drill 0.6)
  Top 0.406: IC2.24 20.95,35.56 18.41,35.56 | IC1.24 20.95,13.97 18.41,13.97 | JMP1.1 JMP2.1 2.11,30.05 5.71,33.66 5.71,34.29 6.99,35.56 v9.53,35.56 8.26,34.29 IC2.14 | 18.41,25.4 v17.14,25.4 | 54.05,34.85 U$1.6 | 53.98,34.92 54.05,34.85 | 53.98,34.92 53.24,35.66 v51.44,35.66 U$1.18 41.22,35.66 | 53.98,33.66 53.98,34.78 54.05,34.85 | U$1.4 54.38,33.26 53.98,33.66 | 53.98,34.92 53.98,33.66 | R13.2 41.22,35.66 | IC1.14 8.26,7.62 v9.53,6.35 | R18.3 29.94,25.3 v29.84,25.4 | 76.2,6.35 SV4.5 | 76.2,6.35 76.2,6.45 IC3.16 74.93,7.62 76.2,6.35 | OK1.1 78.74,33.02 71.12,40.64 71.12,41.91 72.39,43.18 72.39,45.09 71.12,46.35 SV5.2 | R25.2 32.23,46.51 33.66,45.09 SV8.2 | 41.22,35.66 41.22,36.25 v40.64,36.83 | v77.47,6.35 76.2,6.35 | v58.42,20.32 51.99,20.32 51.71,20.6
  Top 0.61: IC2.3 v18.41,36.83 18.41,35.56 IC2.22 18.41,25.4 v18.41,24.13 IC1.3 18.41,13.97 IC1.22 v18.41,6.35
  Top 1.016: U$3.P$4 53.22,13.77 U$4.P$1 51.71,20.6 51.35,20.95 C18.+
  Bottom 0.406: v9.53,35.56 9.53,36.83 v18.41,36.83 | R3.2 50.22,35.71 50.16,35.66 v51.44,35.66 51.47,35.69 C6.1 | 38.1,42.55 37.47,42.55 34.92,45.09 SV8.2 | 38.1,42.55 U$2.2 | v17.14,25.4 v29.84,25.4 | v9.53,6.35 v18.41,6.35 | 38.1,42.55 38.1,39.37 v40.64,36.83 | v77.47,6.35 69.85,6.35 67.94,8.26 67.94,13.34 60.96,20.32 v58.42,20.32
  Bottom 0.61: v18.41,6.35 18.54,6.48 | C6.1 53.47,35.56 55.88,35.56 | v18.41,24.13 27.94,24.13 29.21,22.86 46.23,22.86 C18.+
  Bottom 1.016: C18.+ 47.76,20.58 C20.1 | IC4.1 51.06,19.43 49.53,20.95 C18.+ | C18.+ 55.88,20.95 55.88,35.56 55.88,41.27 58.42,43.81 68.58,43.81 71.12,46.35 SV5.2
VINFILT  (via drill 0.6)
  Top 0.61: IC1.20 v15.88,17.78 IC1.5 IC2.20 v15.88,39.37 IC2.5
  Top 0.813: IC1.20 15.88,5.08 17.78,3.17 D2.C
  Top 1.016: U$3.P$1 47.4,8.66 44.45,5.71 31.62,5.71 C19.+
  Top 1.27: D2.C 28.07,3.17 C19.+
  Bottom 0.406: v15.88,39.37 C7.+ | v15.88,17.78 C8.+